# EAGLE design xmas_pcb_ornament (EAGLE 9.6.2)
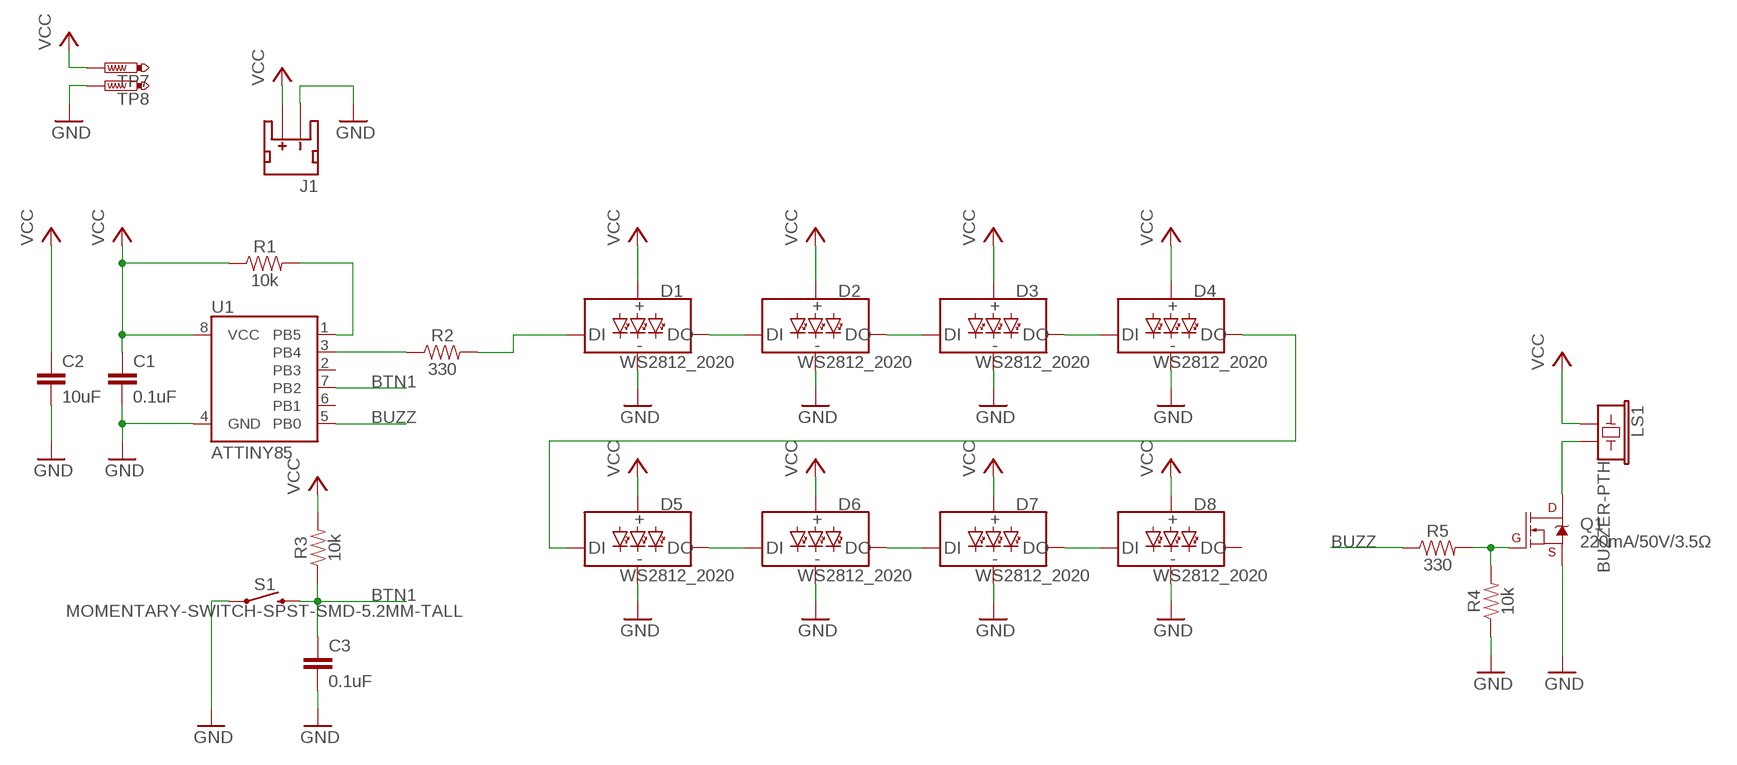
[diagram p0: schematic, sheet 1]

## Parts
C1  0.1uF  0.1UF-0603-25V-(+80/-20%)  [0603]
C2  10uF  10UF-1206-6.3V-20%  [1206]
C3  0.1uF  0.1UF-0603-25V-(+80/-20%)  [0603]
D1  WS2812_2020  [WS2812-2020]
D2  WS2812_2020  [WS2812-2020]
D3  WS2812_2020  [WS2812-2020]
D4  WS2812_2020  [WS2812-2020]
D5  WS2812_2020  [WS2812-2020]
D6  WS2812_2020  [WS2812-2020]
D7  WS2812_2020  [WS2812-2020]
D8  WS2812_2020  [WS2812-2020]
J1  JST_2MM_MALE  [JST-2-SMD]
LS1  BUZZER-PTH  [BUZZER-12MM]
Q1  220mA/50V/3.5Ω  MOSFET-NCH-BSS138  [SOT23-3]
R1  10k  10KOHM-0603-1/10W-1%  [0603]
R2  330  330OHM-0603-1/10W-1%  [0603]
R3  10k  10KOHM-0603-1/10W-1%  [0603]
R4  10k  10KOHM-0603-1/10W-1%  [0603]
R5  330  330OHM-0603-1/10W-1%  [0603]
S1  MOMENTARY-SWITCH-SPST-SMD-5.2MM-TALL  [TACTILE_SWITCH_SMD_5.2MM]
TP7  PTR1TP20R  [TP20R]
TP8  PTR1TP20R  [TP20R]
U1  ATTINY85  [ATTINY85]

## Nets
BTN1: C3.1 R3.1 S1.3 S1.4 U1.7(PB2)
BUZZ: R5.1 U1.5(PB0)
GND: C1.2 C2.2 C3.2 D1.GND D2.GND D3.GND D4.GND D5.GND D6.GND D7.GND D8.GND J1.1(-) Q1.2(S) R4.1 S1.1 S1.2 TP8.TP U1.4(GND)
N$1: Q1.1(G) R4.2 R5.2
N$2: LS1.- Q1.3(D)
N$4: R1.2 U1.1(PB5)
N$5: R2.1 U1.3(PB4)
N$6: D1.DI R2.2
N$7: D1.DO D2.DI
N$8: D2.DO D3.DI
N$9: D3.DO D4.DI
N$10: D4.DO D5.DI
N$11: D5.DO D6.DI
N$12: D6.DO D7.DI
N$13: D7.DO D8.DI
VCC: C1.1 C2.1 D1.VCC D2.VCC D3.VCC D4.VCC D5.VCC D6.VCC D7.VCC D8.VCC J1.2(+) LS1.+ R1.1 R3.2 TP7.TP U1.8(VCC)
Unconnected: D8.DO J1.NC1(PAD1) J1.NC2(PAD2) U1.2(PB3) U1.6(PB1)

## Library data of the parts
C1 C3 = SparkFun-Capacitors:0.1UF: 0.1µF ceramic capacitors A capacitor is a passive two-terminal electrical component used to store electrical energy temporarily in an electric field.; PROD_ID: CAP-00810
C2 = SparkFun-Capacitors:10UF: 10.0µF ceramic capacitors A capacitor is a passive two-terminal electrical component used to store electrical energy temporarily in an electric field.; PROD_ID: CAP-10057
D1-D8 = SparkFun-LED:WS2812: Addressable RGB LED - 1 Wire Common names: WS2812, SK6812, Neopixel, APA-106, etc. SMD LED with built-in controller IC. Color: Red/Green/Blue SparkFun Products: LED-SMD RGB (WS2812) <https://www.sparkfun.com/products/11821> LED - RGB Addressable, PTH, 5mm Diffused (5 Pack) <https://www.sparkfun.com/products/12986> LED - RGB Addressable, PTH, 5mm Clear (5 Pack) <https://www.sparkfun.com/products/12999> Blynk Board - ESP8266 <https://www.sparkfun.com/products/13794> Datasheet referenced for footprint: WS2812B-PTH <https://cdn.sparkfun.com/datasheets/Components/LED/COM-12877.pdf>; PROD_ID: DIO-15591
J1 = SparkFun-Connectors:JST_2MM_MALE: JST 2MM MALE RA CONNECTOR Two pin, compact surface mount connector. Commonly used as a battery input connection point. We really like the solid locking feeling and high current rating on these small connectors. We use these all the time as battery connectors. Mates to single-cell LiPo batteries. Here is the connector we sell at SparkFun: JST Right Angle Connector - White <https://www.sparkfun.com/products/8612> (PRT-08612) Datasheet <http://www.sparkfun.com/datasheets/Prototyping/Connectors/JST-Horizontal.pdf> It was used on these SparkFun products: SparkFun MOSFET Power Controller <https://www.sparkfun.com/products/11214> (PRT-11214) SparkFun Battery Babysitter - LiPo Battery Manager <https://www.sparkfun.com/products/13777> (PRT-13777) And many, many others that required a lipo battery connection.; PROD_ID: CONN-11443; SF_ID: PRT-08612
LS1 = SparkFun-Electromechanical:BUZZER: Buzzer Small round buzzers that operate around the audible 2kHz range. You can use these as speakers to create simple music or user interfaces. Variant Overview: PTH - Mini Speaker - PC Mount 12mm 2.048kHz <https://www.sparkfun.com/products/7950> PTH_KIT - Mini Speaker - PC Mount 12mm 2.048kHz <https://www.sparkfun.com/products/7950> KIT simplifies soldering by adding stop mask to one side of the pads. PTH_NO_SILK - Mini Speaker - PC Mount 12mm 2.048kHz <https://www.sparkfun.com/products/7950> No silkscreen indicator of buzzer outline. PTH_KIT_NO_SILK - Mini Speaker - PC Mount 12mm 2.048kHz <https://www.sparkfun.com/products/7950> KIT package w/o silkscreen SMD - Buzzer Audio Magnetic (CCV-084B16) SMD buzzer used on, e.g. the LilyPad Buzzer <https://www.sparkfun.com/products/8463> and RFID USB Reader <https://www.sparkfun.com/products/9963>. SMD_KIT - Buzzer Audio Magnetic (CCV-084B16) SMD Buzzer with elongated pins to make soldering easier. Used on the SparkFun Simon Says - Surface Mount Soldering Kit <https://www.sparkfun.com/products/10935>. SMD-SQUARE - Buzzer Audio Magnetic (COMP-15701) SMT square buzzer with one chamfered corner.; PROD_ID: COMP-08253; SF_SKU: COM-07950
Q1 = SparkFun-DiscreteSemi:MOSFET-NCH: N-channel MOSFETs Voltage controlled devices that allow control of high current outputs. SparkFun Products: SparkFun OpenScale <https://www.sparkfun.com/products/13261> SparkFun Digital Sandbox <https://www.sparkfun.com/products/12651> SparkFun Monster Moto Shield <https://www.sparkfun.com/products/10182> SparkFun MOSFET Power Controller <https://www.sparkfun.com/products/11214>; PROD_ID: TRANS-00830
R1 R3 R4 = SparkFun-Resistors:10KOHM: 10kΩ resistor A resistor is a passive two-terminal electrical component that implements electrical resistance as a circuit element. Resistors act to reduce current flow, and, at the same time, act to lower voltage levels within circuits. - Wikipedia; PROD_ID: RES-00824
R2 R5 = SparkFun-Resistors:330OHM: 330Ω resistor A resistor is a passive two-terminal electrical component that implements electrical resistance as a circuit element. Resistors act to reduce current flow, and, at the same time, act to lower voltage levels within circuits. - Wikipedia; PROD_ID: RES-00818
S1 = SparkFun-Switches:MOMENTARY-SWITCH-SPST: Momentary Switch (Pushbutton) - SPST Normally-open (NO) SPST momentary switches (buttons, pushbuttons). Variants PTH-12MM - 12mm square, through-hole Momentary Pushbutton Switch - 12mm Square <https://www.sparkfun.com/products/9190> (COM-09190) PTH-6.0MM, PTH-6.0MM-KIT - 6.0mm square, through-hole Mini Pushbutton Switch <https://www.sparkfun.com/products/97> (COM-00097) KIT package intended for soldering kit's - only one side of pads' copper is exposed. PTH-RIGHT-ANGLE-KIT - Right-angle, through-hole Right Angle Tactile Button <https://www.sparkfun.com/products/10791> - Used on SparkFun BigTime Watch Kit <https://www.sparkfun.com/products/11734> SMD-12MM - 12mm square, surface-mount Tactile Button - SMD (12mm) <https://www.sparkfun.com/products/12993> (COM-12993) Used on SparkFun PicoBoard <https://www.sparkfun.com/products/11888> SMD-4.5MM - 4.5mm Square Trackball Switch Used on SparkFun Blackberry Trackballer Breakout <https://www.sparkfun.com/products/13169> SMD-4.6MMX2.8MM - 4.60mm x 2.80mm, surface mount Used on SparkFun Pro Micro - RP2040 <https://www.sparkfun.com/products/17717> SMD-5.2MM, SMD-5.2-REDUNDANT - 5.2mm square, surface-mount Mini Pushbutton Switch - SMD <https://www.sparkfun.com/products/8720> (COM-08720) Used on Arduino Pro Mini <https://www.sparkfun.com/products/11114> REDUNDANT package connects both switch circuits together SMD-6.0X3.5MM - 6.0 x 3.5mm, surface mount Momentary Reset Switch SMD <https://www.sparkfun.com/products/8229> (COM-08229) SMD-6.2MM-TALL - 6.2mm square, surface mount Tactile Button - SMD (6mm) <https://www.sparkfun.com/products/12992> Used on SparkFun Digital Sandbox <https://www.sparkfun.com/products/12651> SMD-RIGHT-ANGLE - Right-angle, surface mount Used on SparkFun Block for Intel® Edison - Arduino <https://www.sparkfun.com/products/13036>; PROD_ID: SWCH-14139
TP7 TP8 = testpad:PTR1: TEST PIN
U1 = SparkFun-IC-Microcontroller:ATTINY85; PROD_ID: IC-09092

## Board
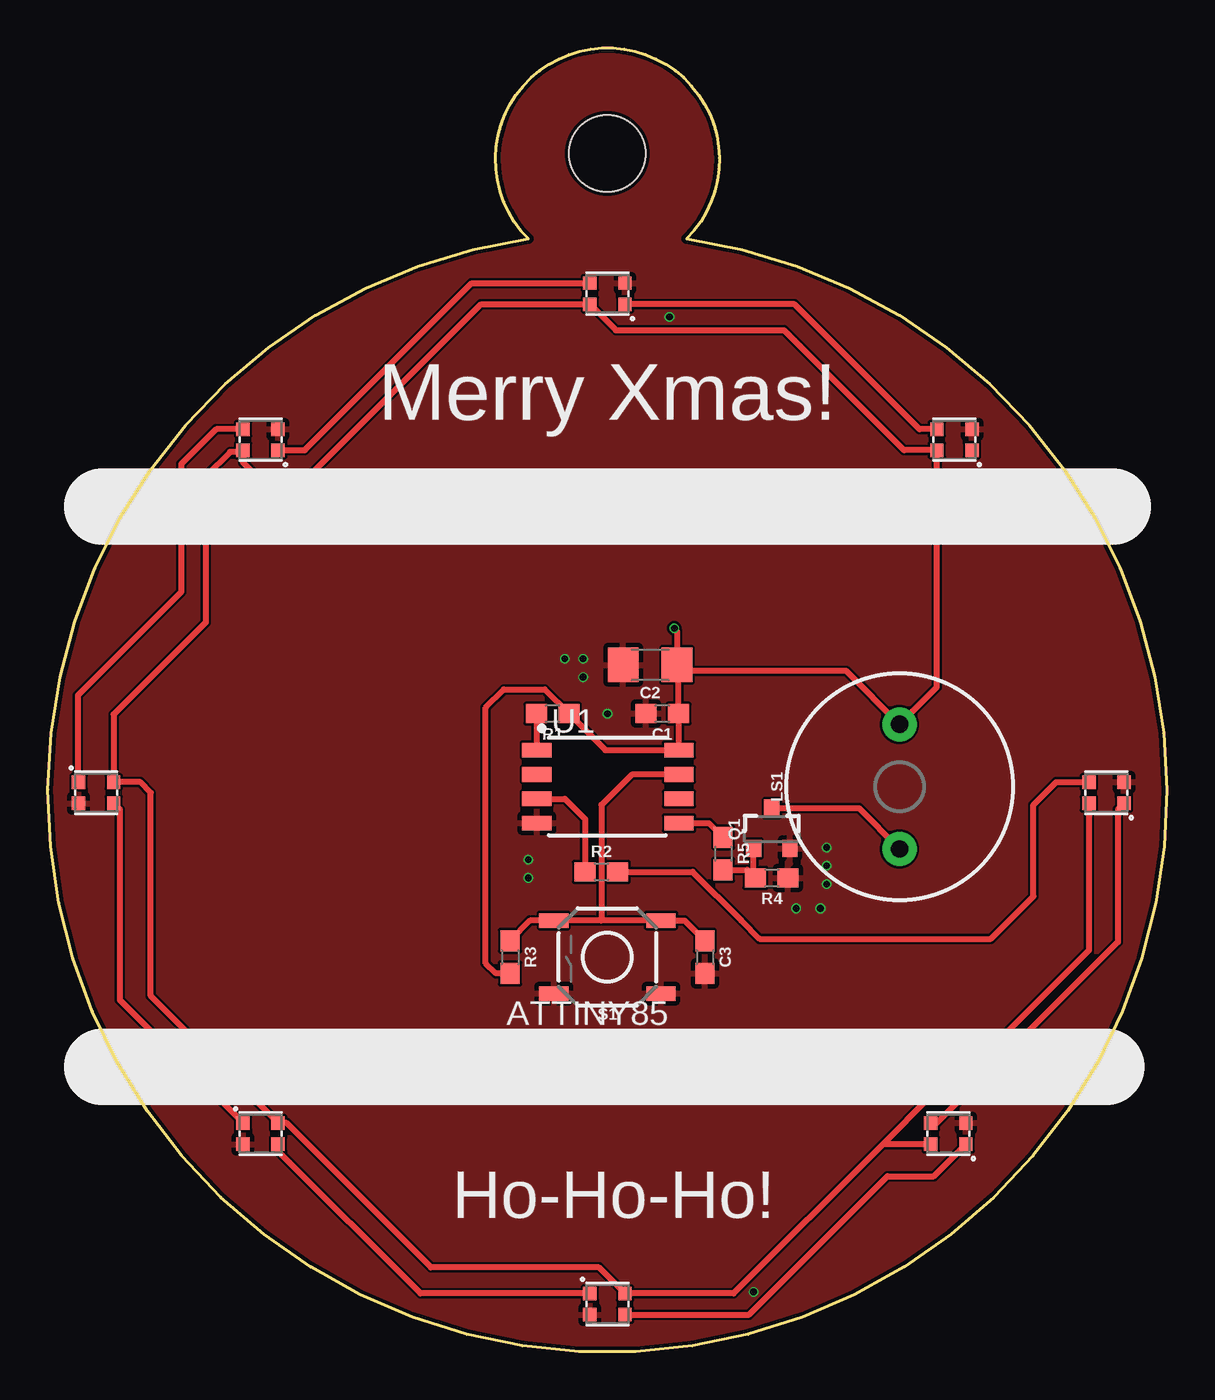
[diagram p1: board, top side]
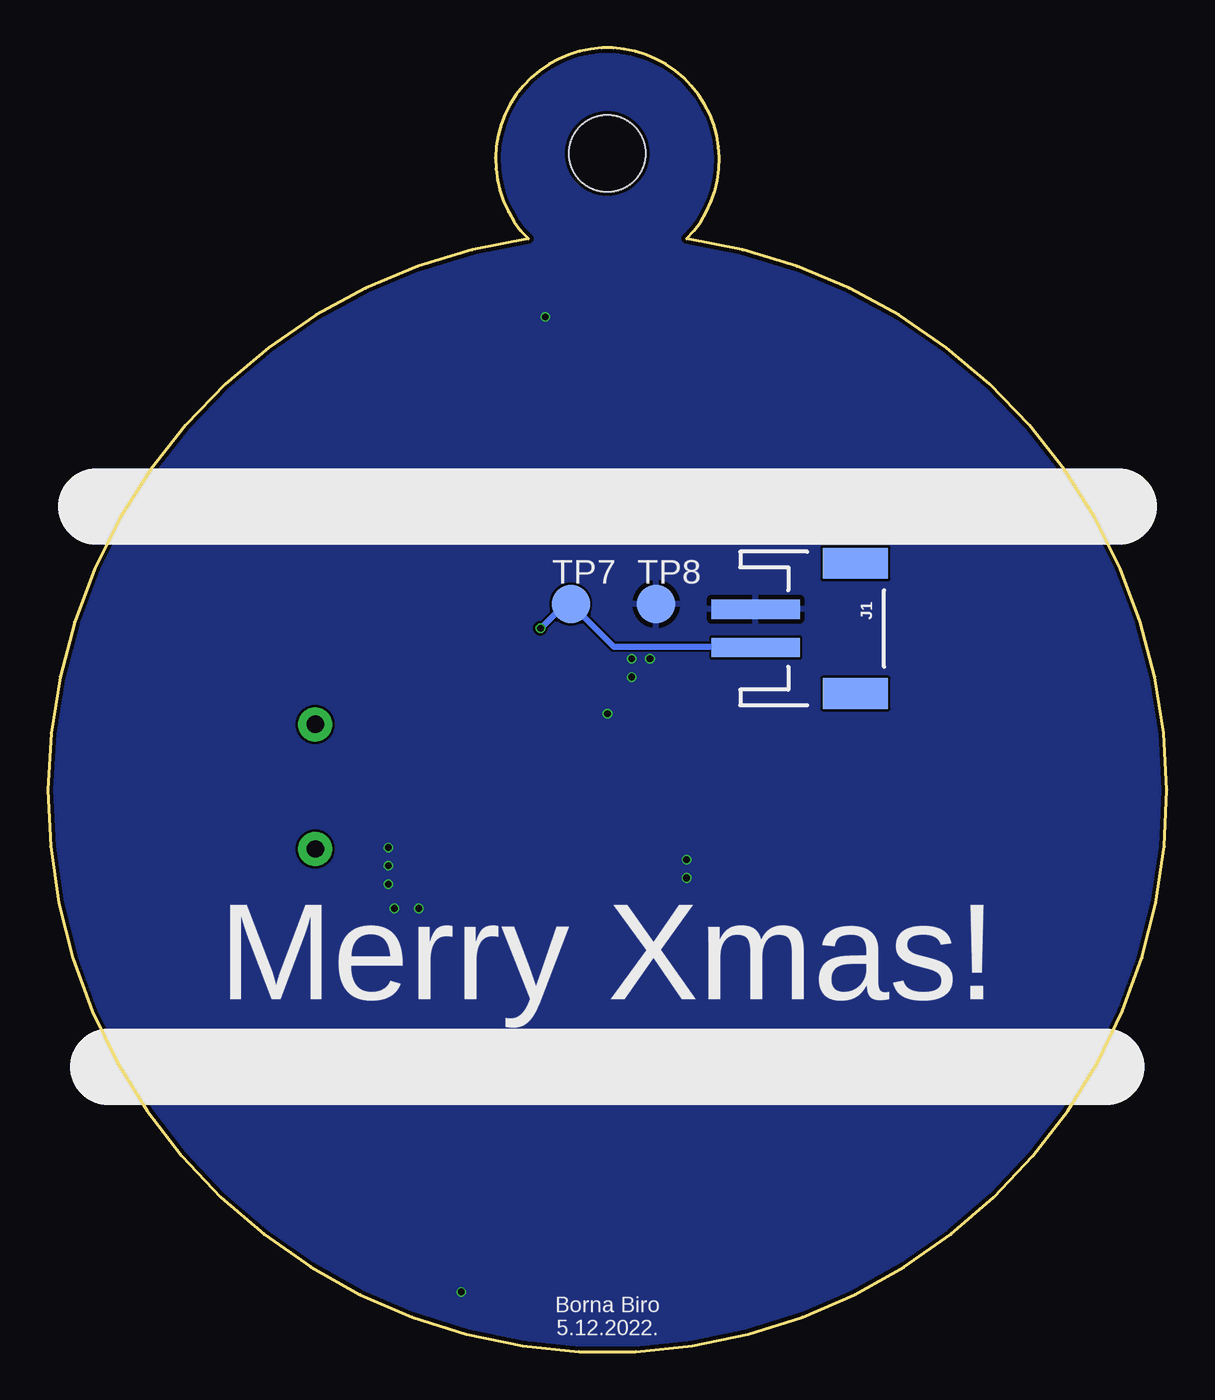
[diagram p2: board, bottom side, seen from below]

Size 58.37 x 68 mm. Coordinates in mm from the lower left corner, seen from the top.
Outline: 33.31,58.04 arc-344 25.06,58.04 arc-270 33.31,58.04
Copper layers (1*16): Top 0.035mm / dielectric 1.6mm / Bottom 0.035mm
Design rules "jlcpcb-2layers *": minimum track width 5mil, minimum drill 0.3mm, track to track 5mil, track to pad 5mil, pad to pad 5mil, via to via 5mil, smd to smd 5mil, copper to edge 0.2mm, drill to drill 6mil, minimum pad ring 10mil, minimum via ring 3mil, stop-mask expansion 4mil, vias tented up to drill 0.6mm, thermal gap 10mil
Holes 4 mm at 29.19,62.49

### Footprints (pad centres in the part's own frame; a part is rotated, then mirrored left to right if it is on the bottom)
0603 = smd 1.1 x 1: 1 -0.85,0; 2 0.85,0
1206 = smd 1.6 x 1.8: 1 -1.4,0; 2 1.4,0
WS2812-2020 = smd 0.7 x 0.7: DI -0.915,0.55; DO 0.915,-0.55; GND 0.915,0.55; VCC -0.915,-0.55
JST-2-SMD = smd 1 x 4.6: 1 -1,-3.7; 2 1,-3.7 | smd 1.6 x 3.4: NC1 -3.4,1.5; NC2 3.4,1.5
BUZZER-12MM = drill 0.9 pad 1.778: + 3.25,0; - -3.25,0
SOT23-3 = smd 0.8 x 0.9: 1 -0.95,-1; 2 0.95,-1; 3 0,1.1
TACTILE_SWITCH_SMD_5.2MM = smd 1.524 x 0.762: 1 -2.794,1.905; 2 2.794,1.905; 3 -2.794,-1.905; 4 2.794,-1.905
TP20R = smd 2 x 2: TP 0,0
ATTINY85 = smd 1.524 x 0.762: 1 -3.683,1.905; 2 -3.683,0.635; 3 -3.683,-0.635; 4 -3.683,-1.905; 5 3.727,-1.905; 6 3.727,-0.635; 7 3.727,0.635; 8 3.727,1.905

### Placement (x,y rotation side)
C1  32.04,33.28 180 top
C2  31.41,35.82 180 top
C3  34.27,20.58 270 top
D1  55.22,29.15 0 top
D2  46.97,11.37 0 top
D3  29.19,2.48 180 top
D4  11.09,11.37 180 top
D5  2.52,29.15 180 top
D6  11.09,47.56 0 top
D7  29.19,55.18 0 top
D8  47.28,47.56 0 top
J1  17.76,37.72 270 bottom
LS1  44.43,29.47 90 top
Q1  37.76,27.24 0 top
R1  26.33,33.28 180 top
R2  28.87,25.02 0 top
R3  24.11,20.58 270 top
R4  37.76,24.7 180 top
R5  35.22,25.97 270 top
S1  29.19,20.58 180 top
TP7  31.09,38.99 0 bottom
TP8  26.65,38.99 0 bottom
U1  29.19,29.47 0 top

### Tracks (layer width: path | path; a pad name or v marks a point on that pad's centre or on a via)
BTN1
  Top 0.305: U1.7 30.46,30.1 28.87,28.51 28.87,22.48 | 28.87,22.48 S1.3 33.21,22.48 C3.1 | 28.87,22.48 S1.4 25.16,22.48 R3.1
BUZZ
  Top 0.305: U1.5 34.48,27.56 R5.1
GND  (via drill 0.35)
  other vias: 27.92,36.13 27.92,35.18 26.96,36.13 29.19,33.28 25.06,25.66 25.06,24.7 40.62,26.29 40.62,25.34 40.62,24.39 40.3,23.12 39.03,23.12 32.42,53.98 36.81,3.11
  pour Top: -0.02,-0.06 61.57,-0.06 61.57,41.53 61.57,71.38 -0.02,71.38
  pour Bottom: -0.02,-0.06 61.89,-0.06 61.89,8.51 61.89,70.74 -0.02,70.74
N$1
  Top 0.305: R5.2 36.49,25.12 R4.2 36.81,24.8 Q1.1
N$2
  Top 0.305: Q1.3 42.3,28.34 LS1.-
N$4
  Top 0.305: R1.2 25.48,31.4 U1.1
N$5
  Top 0.305: U1.3 26.96,28.83 28.02,27.78 R2.1
N$6
  Top 0.305: R2.2 33.63,25.02 36.17,22.48 37.12,21.53 49.19,21.53 51.41,23.75 51.41,28.51 52.6,29.7 D1.DI
N$7
  Top 0.305: D2.DI 46.37,11.92 55.81,21.36 55.81,28.28 D1.DO
N$8
  Top 0.305: D3.DI 36.57,1.93 43.79,9.15 46.21,9.15 D2.DO
N$9
  Top 0.305: D3.DO 19.43,3.03 12,10.45 D4.DI
N$10
  Top 0.305: D4.DO 3.75,18.34 3.75,28.28 D5.DI
N$11
  Top 0.305: D5.DO 1.56,29.74 1.56,34.23 6.96,39.63 6.96,46.29 8.78,48.11 D6.DI
N$12
  Top 0.305: D6.DO 13.4,47.01 22.11,55.73 D7.DI
N$13
  Top 0.305: D8.DI 45.46,48.11 38.95,54.63 D7.DO
VCC  (via drill 0.35)
  Top 0.305: 32.89,35.5 C1.1 32.91,33.26 U1.8 29.08,31.37 R1.1 25.91,34.55 23.79,34.55 22.84,33.59 22.84,20.26 23.37,19.73 R3.2 | 32.89,35.5 32.89,35.73 C2.1 32.81,37.59 v32.68,37.72 | D1.VCC 54.3,20.93 46.65,13.27 46.01,13.27 43.56,10.82 | 43.56,10.82 35.77,3.03 D3.VCC 28.75,4.38 19.98,4.38 12.44,11.92 D4.VCC 5.37,18.55 5.37,29.15 4.82,29.7 D5.VCC 3.43,33.24 8.23,38.04 8.23,45.66 9.5,46.93 10.09,46.93 D6.VCC 10.17,46.38 10.89,45.66 13.63,45.66 22.6,54.63 D7.VCC 29.62,53.28 38.39,53.28 44.66,47.01 D8.VCC 46.37,34.66 LS1.+ 41.64,35.5 32.89,35.5 | D2.VCC 43.56,10.82
  Bottom 0.305: v32.68,37.72 31.41,38.99 TP7.TP 28.87,36.77 21.5,36.77 J1.2

### Text on the board
topSilk: Merry Xmas! | Ho-Ho-Ho!
bottomSilk: Merry Xmas! | Borna Biro / 5.12.2022.